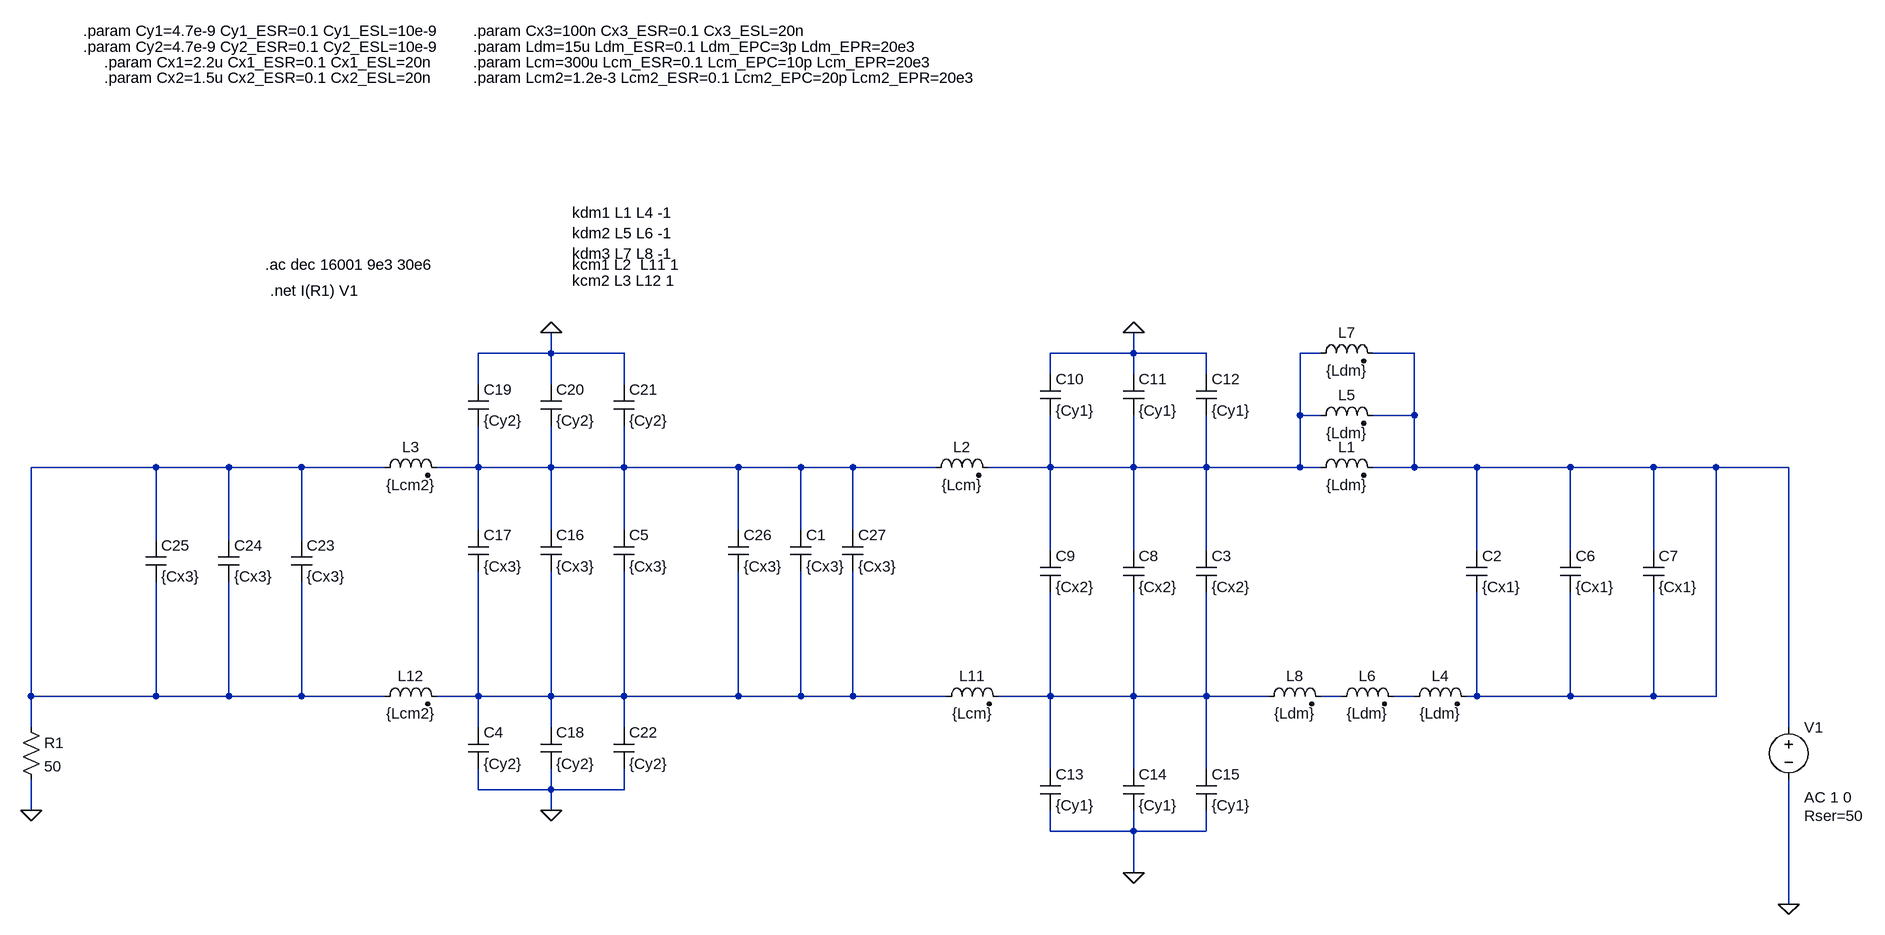
[diagram p0: schematic Simulation_PEF_1phase.asc]
Simulation_PEF_1phase.asc, the LTspice schematic file:
Version 4
SHEET 1 1792 1872
WIRE -496 -192 -496 -224
WIRE -496 -192 -608 -192
WIRE -384 -192 -496 -192
WIRE 400 -192 400 -224
WIRE 400 -192 272 -192
WIRE 512 -192 400 -192
WIRE 688 -192 656 -192
WIRE 832 -192 768 -192
WIRE 272 -160 272 -192
WIRE 400 -160 400 -192
WIRE 512 -160 512 -192
WIRE -608 -144 -608 -192
WIRE -496 -144 -496 -192
WIRE -384 -144 -384 -192
WIRE 656 -96 656 -192
WIRE 688 -96 656 -96
WIRE 832 -96 832 -192
WIRE 832 -96 768 -96
WIRE -1104 -16 -1296 -16
WIRE -992 -16 -1104 -16
WIRE -880 -16 -992 -16
WIRE -752 -16 -880 -16
WIRE -608 -16 -608 -80
WIRE -608 -16 -672 -16
WIRE -496 -16 -496 -80
WIRE -496 -16 -608 -16
WIRE -384 -16 -384 -80
WIRE -384 -16 -496 -16
WIRE -208 -16 -384 -16
WIRE -112 -16 -208 -16
WIRE -32 -16 -112 -16
WIRE 96 -16 -32 -16
WIRE 272 -16 272 -96
WIRE 272 -16 176 -16
WIRE 400 -16 400 -96
WIRE 400 -16 272 -16
WIRE 512 -16 512 -96
WIRE 512 -16 400 -16
WIRE 656 -16 656 -96
WIRE 656 -16 512 -16
WIRE 688 -16 656 -16
WIRE 832 -16 832 -96
WIRE 832 -16 768 -16
WIRE 928 -16 832 -16
WIRE 1072 -16 928 -16
WIRE 1200 -16 1072 -16
WIRE 1296 -16 1200 -16
WIRE 1408 -16 1296 -16
WIRE -608 80 -608 -16
WIRE -496 80 -496 -16
WIRE -384 80 -384 -16
WIRE -208 80 -208 -16
WIRE -112 80 -112 -16
WIRE -32 80 -32 -16
WIRE -1104 96 -1104 -16
WIRE -992 96 -992 -16
WIRE -880 96 -880 -16
WIRE 272 112 272 -16
WIRE 400 112 400 -16
WIRE 512 112 512 -16
WIRE 928 112 928 -16
WIRE 1072 112 1072 -16
WIRE 1200 112 1200 -16
WIRE -1296 336 -1296 -16
WIRE -1104 336 -1104 160
WIRE -1104 336 -1296 336
WIRE -992 336 -992 160
WIRE -992 336 -1104 336
WIRE -880 336 -880 160
WIRE -880 336 -992 336
WIRE -752 336 -880 336
WIRE -608 336 -608 144
WIRE -608 336 -672 336
WIRE -496 336 -496 144
WIRE -496 336 -608 336
WIRE -384 336 -384 144
WIRE -384 336 -496 336
WIRE -208 336 -208 144
WIRE -208 336 -384 336
WIRE -112 336 -112 144
WIRE -112 336 -208 336
WIRE -32 336 -32 144
WIRE -32 336 -112 336
WIRE 112 336 -32 336
WIRE 272 336 272 176
WIRE 272 336 192 336
WIRE 400 336 400 176
WIRE 400 336 272 336
WIRE 512 336 512 176
WIRE 512 336 400 336
WIRE 608 336 512 336
WIRE 720 336 688 336
WIRE 832 336 800 336
WIRE 928 336 928 176
WIRE 928 336 912 336
WIRE 1072 336 1072 176
WIRE 1072 336 928 336
WIRE 1200 336 1200 176
WIRE 1200 336 1072 336
WIRE 1296 336 1296 -16
WIRE 1296 336 1200 336
WIRE -1296 384 -1296 336
WIRE -608 384 -608 336
WIRE -496 384 -496 336
WIRE -384 384 -384 336
WIRE 1408 384 1408 -16
WIRE 272 448 272 336
WIRE 400 448 400 336
WIRE 512 448 512 336
WIRE -608 480 -608 448
WIRE -496 480 -496 448
WIRE -496 480 -608 480
WIRE -384 480 -384 448
WIRE -384 480 -496 480
WIRE -1296 512 -1296 464
WIRE -496 512 -496 480
WIRE 272 544 272 512
WIRE 400 544 400 512
WIRE 400 544 272 544
WIRE 512 544 512 512
WIRE 512 544 400 544
WIRE 400 608 400 544
WIRE 1408 656 1408 464
FLAG 400 608 0
FLAG 400 -224 0
FLAG -496 -224 0
FLAG -496 512 0
FLAG -1296 512 0
FLAG 1408 656 0
SYMBOL ind2 672 0 R270
WINDOW 0 32 56 VTop 2
WINDOW 3 5 56 VBottom 2
SYMATTR InstName L1
SYMATTR Value {Ldm}
SYMATTR Type ind
SYMATTR SpiceLine Rser={Ldm_ESR} Rpar={Ldm_EPR} Cpar={Ldm_EPC}
SYMBOL cap 912 112 R0
SYMATTR InstName C2
SYMATTR Value {Cx1}
SYMATTR SpiceLine Rser={Cx1_ESR} Lser={Cx1_ESL}
SYMBOL cap 496 112 R0
SYMATTR InstName C3
SYMATTR Value {Cx2}
SYMATTR SpiceLine Rser={Cx2_ESR} Lser={Cx2_ESL}
SYMBOL ind2 80 0 R270
WINDOW 0 32 56 VTop 2
WINDOW 3 5 56 VBottom 2
SYMATTR InstName L2
SYMATTR Value {Lcm}
SYMATTR Type ind
SYMATTR SpiceLine Rser={Lcm_ESR} Rpar={Lcm_EPR} Cpar={Lcm_EPC}
SYMBOL ind2 -768 0 R270
WINDOW 0 32 56 VTop 2
WINDOW 3 5 56 VBottom 2
SYMATTR InstName L3
SYMATTR Value {Lcm2}
SYMATTR Type ind
SYMATTR SpiceLine Rser={Lcm2_ESR} Rpar={Lcm2_EPR} Cpar={Lcm2_EPC}
SYMBOL cap -624 384 R0
SYMATTR InstName C4
SYMATTR Value {Cy2}
SYMATTR SpiceLine Rser={Cy2_ESR} Lser={Cy2_ESL}
SYMBOL cap -400 80 R0
SYMATTR InstName C5
SYMATTR Value {Cx3}
SYMATTR SpiceLine Rser={Cx3_ESR} Lser={Cx3_ESL}
SYMBOL cap 1056 112 R0
SYMATTR InstName C6
SYMATTR Value {Cx1}
SYMATTR SpiceLine Rser={Cx1_ESR} Lser={Cx1_ESL}
SYMBOL cap 1184 112 R0
SYMATTR InstName C7
SYMATTR Value {Cx1}
SYMATTR SpiceLine Rser={Cx1_ESR} Lser={Cx1_ESL}
SYMBOL ind2 816 352 R270
WINDOW 0 32 56 VTop 2
WINDOW 3 5 56 VBottom 2
SYMATTR InstName L4
SYMATTR Value {Ldm}
SYMATTR Type ind
SYMATTR SpiceLine Rser={Ldm_ESR} Rpar={Ldm_EPR} Cpar={Ldm_EPC}
SYMBOL ind2 704 352 R270
WINDOW 0 32 56 VTop 2
WINDOW 3 5 56 VBottom 2
SYMATTR InstName L6
SYMATTR Value {Ldm}
SYMATTR Type ind
SYMATTR SpiceLine Rser={Ldm_ESR} Rpar={Ldm_EPR} Cpar={Ldm_EPC}
SYMBOL ind2 592 352 R270
WINDOW 0 32 56 VTop 2
WINDOW 3 5 56 VBottom 2
SYMATTR InstName L8
SYMATTR Value {Ldm}
SYMATTR Type ind
SYMATTR SpiceLine Rser={Ldm_ESR} Rpar={Ldm_EPR} Cpar={Ldm_EPC}
SYMBOL cap 384 112 R0
SYMATTR InstName C8
SYMATTR Value {Cx2}
SYMATTR SpiceLine Rser={Cx2_ESR} Lser={Cx2_ESL}
SYMBOL cap 256 112 R0
SYMATTR InstName C9
SYMATTR Value {Cx2}
SYMATTR SpiceLine Rser={Cx2_ESR} Lser={Cx2_ESL}
SYMBOL ind2 96 352 R270
WINDOW 0 32 56 VTop 2
WINDOW 3 5 56 VBottom 2
SYMATTR InstName L11
SYMATTR Value {Lcm}
SYMATTR Type ind
SYMATTR SpiceLine Rser={Lcm_ESR} Rpar={Lcm_EPR} Cpar={Lcm_EPC}
SYMBOL cap 256 -160 R0
SYMATTR InstName C10
SYMATTR Value {Cy1}
SYMATTR SpiceLine Rser={Cy1_ESR} Lser={Cy1_ESL}
SYMBOL cap 384 -160 R0
SYMATTR InstName C11
SYMATTR Value {Cy1}
SYMATTR SpiceLine Rser={Cy1_ESR} Lser={Cy1_ESL}
SYMBOL cap 496 -160 R0
SYMATTR InstName C12
SYMATTR Value {Cy1}
SYMATTR SpiceLine Rser={Cy1_ESR} Lser={Cy1_ESL}
SYMBOL cap 256 448 R0
SYMATTR InstName C13
SYMATTR Value {Cy1}
SYMATTR SpiceLine Rser={Cy1_ESR} Lser={Cy1_ESL}
SYMBOL cap 384 448 R0
SYMATTR InstName C14
SYMATTR Value {Cy1}
SYMATTR SpiceLine Rser={Cy1_ESR} Lser={Cy1_ESL}
SYMBOL cap 496 448 R0
SYMATTR InstName C15
SYMATTR Value {Cy1}
SYMATTR SpiceLine Rser={Cy1_ESR} Lser={Cy1_ESL}
SYMBOL cap -512 80 R0
SYMATTR InstName C16
SYMATTR Value {Cx3}
SYMATTR SpiceLine Rser={Cx3_ESR} Lser={Cx3_ESL}
SYMBOL cap -624 80 R0
SYMATTR InstName C17
SYMATTR Value {Cx3}
SYMATTR SpiceLine Rser={Cx3_ESR} Lser={Cx3_ESL}
SYMBOL ind2 -768 352 R270
WINDOW 0 32 56 VTop 2
WINDOW 3 5 56 VBottom 2
SYMATTR InstName L12
SYMATTR Value {Lcm2}
SYMATTR Type ind
SYMATTR SpiceLine Rser={Lcm2_ESR} Rpar={Lcm2_EPR} Cpar={Lcm2_EPC}
SYMBOL cap -512 384 R0
SYMATTR InstName C18
SYMATTR Value {Cy2}
SYMATTR SpiceLine Rser={Cy2_ESR} Lser={Cy2_ESL}
SYMBOL cap -624 -144 R0
SYMATTR InstName C19
SYMATTR Value {Cy2}
SYMATTR SpiceLine Rser={Cy2_ESR} Lser={Cy2_ESL}
SYMBOL cap -512 -144 R0
SYMATTR InstName C20
SYMATTR Value {Cy2}
SYMATTR SpiceLine Rser={Cy2_ESR} Lser={Cy2_ESL}
SYMBOL cap -400 -144 R0
SYMATTR InstName C21
SYMATTR Value {Cy2}
SYMATTR SpiceLine Rser={Cy2_ESR} Lser={Cy2_ESL}
SYMBOL cap -400 384 R0
SYMATTR InstName C22
SYMATTR Value {Cy2}
SYMATTR SpiceLine Rser={Cy2_ESR} Lser={Cy2_ESL}
SYMBOL cap -896 96 R0
SYMATTR InstName C23
SYMATTR Value {Cx3}
SYMATTR SpiceLine Rser={Cx3_ESR} Lser={Cx3_ESL}
SYMBOL cap -1008 96 R0
SYMATTR InstName C24
SYMATTR Value {Cx3}
SYMATTR SpiceLine Rser={Cx3_ESR} Lser={Cx3_ESL}
SYMBOL cap -1120 96 R0
SYMATTR InstName C25
SYMATTR Value {Cx3}
SYMATTR SpiceLine Rser={Cx3_ESR} Lser={Cx3_ESL}
SYMBOL voltage 1408 368 R0
WINDOW 123 24 124 Left 2
WINDOW 39 24 152 Left 2
SYMATTR Value2 AC 1 0
SYMATTR SpiceLine Rser=50
SYMATTR InstName V1
SYMATTR Value ""
SYMBOL res -1312 368 R0
SYMATTR InstName R1
SYMATTR Value 50
SYMBOL cap -224 80 R0
SYMATTR InstName C26
SYMATTR Value {Cx3}
SYMATTR SpiceLine Rser={Cx3_ESR} Lser={Cx3_ESL}
SYMBOL cap -128 80 R0
SYMATTR InstName C1
SYMATTR Value {Cx3}
SYMATTR SpiceLine Rser={Cx3_ESR} Lser={Cx3_ESL}
SYMBOL cap -48 80 R0
SYMATTR InstName C27
SYMATTR Value {Cx3}
SYMATTR SpiceLine Rser={Cx3_ESR} Lser={Cx3_ESL}
SYMBOL ind2 672 -80 R270
WINDOW 0 32 56 VTop 2
WINDOW 3 5 56 VBottom 2
SYMATTR InstName L5
SYMATTR Value {Ldm}
SYMATTR Type ind
SYMATTR SpiceLine Rser={Ldm_ESR} Rpar={Ldm_EPR} Cpar={Ldm_EPC}
SYMBOL ind2 672 -176 R270
WINDOW 0 32 56 VTop 2
WINDOW 3 5 56 VBottom 2
SYMATTR InstName L7
SYMATTR Value {Ldm}
SYMATTR Type ind
SYMATTR SpiceLine Rser={Ldm_ESR} Rpar={Ldm_EPR} Cpar={Ldm_EPC}
TEXT -1216 -664 Left 2 !.param Cy2=4.7e-9 Cy2_ESR=0.1 Cy2_ESL=10e-9
TEXT -1184 -640 Left 2 !.param Cx1=2.2u Cx1_ESR=0.1 Cx1_ESL=20n
TEXT -1216 -688 Left 2 !.param Cy1=4.7e-9 Cy1_ESR=0.1 Cy1_ESL=10e-9
TEXT -1184 -616 Left 2 !.param Cx2=1.5u Cx2_ESR=0.1 Cx2_ESL=20n
TEXT -616 -688 Left 2 !.param Cx3=100n Cx3_ESR=0.1 Cx3_ESL=20n
TEXT -616 -664 Left 2 !.param Ldm=15u Ldm_ESR=0.1 Ldm_EPC=3p Ldm_EPR=20e3
TEXT -616 -640 Left 2 !.param Lcm=300u Lcm_ESR=0.1 Lcm_EPC=10p Lcm_EPR=20e3
TEXT -616 -616 Left 2 !.param Lcm2=1.2e-3 Lcm2_ESR=0.1 Lcm2_EPC=20p Lcm2_EPR=20e3
TEXT -464 -408 Left 2 !kdm1 L1 L4 -1\nkdm2 L5 L6 -1\nkdm3 L7 L8 -1
TEXT -464 -328 Left 2 !kcm1 L2  L11 1
TEXT -464 -304 Left 2 !kcm2 L3 L12 1
TEXT -928 -288 Left 2 !.net I(R1) V1
TEXT -936 -328 Left 2 !.ac dec 16001 9e3 30e6

The netlist it stands for:
* Simulation_PEF_1phase.asc
L1 N001 N002 {Ldm} Rser={Ldm_ESR} Rpar={Ldm_EPR} Cpar={Ldm_EPC}
C2 N002 N002 {Cx1} Rser={Cx1_ESR} Lser={Cx1_ESL}
C3 N001 N006 {Cx2} Rser={Cx2_ESR} Lser={Cx2_ESL}
L2 N004 N001 {Lcm} Rser={Lcm_ESR} Rpar={Lcm_EPR} Cpar={Lcm_EPC}
L3 N003 N004 {Lcm2} Rser={Lcm2_ESR} Rpar={Lcm2_EPR} Cpar={Lcm2_EPC}
C4 N005 0 {Cy2} Rser={Cy2_ESR} Lser={Cy2_ESL}
C5 N004 N005 {Cx3} Rser={Cx3_ESR} Lser={Cx3_ESL}
C6 N002 N002 {Cx1} Rser={Cx1_ESR} Lser={Cx1_ESL}
C7 N002 N002 {Cx1} Rser={Cx1_ESR} Lser={Cx1_ESL}
L4 N008 N002 {Ldm} Rser={Ldm_ESR} Rpar={Ldm_EPR} Cpar={Ldm_EPC}
L6 N007 N008 {Ldm} Rser={Ldm_ESR} Rpar={Ldm_EPR} Cpar={Ldm_EPC}
L8 N006 N007 {Ldm} Rser={Ldm_ESR} Rpar={Ldm_EPR} Cpar={Ldm_EPC}
C8 N001 N006 {Cx2} Rser={Cx2_ESR} Lser={Cx2_ESL}
C9 N001 N006 {Cx2} Rser={Cx2_ESR} Lser={Cx2_ESL}
L11 N005 N006 {Lcm} Rser={Lcm_ESR} Rpar={Lcm_EPR} Cpar={Lcm_EPC}
C10 0 N001 {Cy1} Rser={Cy1_ESR} Lser={Cy1_ESL}
C11 0 N001 {Cy1} Rser={Cy1_ESR} Lser={Cy1_ESL}
C12 0 N001 {Cy1} Rser={Cy1_ESR} Lser={Cy1_ESL}
C13 N006 0 {Cy1} Rser={Cy1_ESR} Lser={Cy1_ESL}
C14 N006 0 {Cy1} Rser={Cy1_ESR} Lser={Cy1_ESL}
C15 N006 0 {Cy1} Rser={Cy1_ESR} Lser={Cy1_ESL}
C16 N004 N005 {Cx3} Rser={Cx3_ESR} Lser={Cx3_ESL}
C17 N004 N005 {Cx3} Rser={Cx3_ESR} Lser={Cx3_ESL}
L12 N003 N005 {Lcm2} Rser={Lcm2_ESR} Rpar={Lcm2_EPR} Cpar={Lcm2_EPC}
C18 N005 0 {Cy2} Rser={Cy2_ESR} Lser={Cy2_ESL}
C19 0 N004 {Cy2} Rser={Cy2_ESR} Lser={Cy2_ESL}
C20 0 N004 {Cy2} Rser={Cy2_ESR} Lser={Cy2_ESL}
C21 0 N004 {Cy2} Rser={Cy2_ESR} Lser={Cy2_ESL}
C22 N005 0 {Cy2} Rser={Cy2_ESR} Lser={Cy2_ESL}
C23 N003 N003 {Cx3} Rser={Cx3_ESR} Lser={Cx3_ESL}
C24 N003 N003 {Cx3} Rser={Cx3_ESR} Lser={Cx3_ESL}
C25 N003 N003 {Cx3} Rser={Cx3_ESR} Lser={Cx3_ESL}
V1 N002 0 AC 1 0 Rser=50
R1 N003 0 50
C26 N004 N005 {Cx3} Rser={Cx3_ESR} Lser={Cx3_ESL}
C1 N004 N005 {Cx3} Rser={Cx3_ESR} Lser={Cx3_ESL}
C27 N004 N005 {Cx3} Rser={Cx3_ESR} Lser={Cx3_ESL}
L5 N001 N002 {Ldm} Rser={Ldm_ESR} Rpar={Ldm_EPR} Cpar={Ldm_EPC}
L7 N001 N002 {Ldm} Rser={Ldm_ESR} Rpar={Ldm_EPR} Cpar={Ldm_EPC}
.param Cy2=4.7e-9 Cy2_ESR=0.1 Cy2_ESL=10e-9
.param Cx1=2.2u Cx1_ESR=0.1 Cx1_ESL=20n
.param Cy1=4.7e-9 Cy1_ESR=0.1 Cy1_ESL=10e-9
.param Cx2=1.5u Cx2_ESR=0.1 Cx2_ESL=20n
.param Cx3=100n Cx3_ESR=0.1 Cx3_ESL=20n
.param Ldm=15u Ldm_ESR=0.1 Ldm_EPC=3p Ldm_EPR=20e3
.param Lcm=300u Lcm_ESR=0.1 Lcm_EPC=10p Lcm_EPR=20e3
.param Lcm2=1.2e-3 Lcm2_ESR=0.1 Lcm2_EPC=20p Lcm2_EPR=20e3
kdm1 L1 L4 -1
kdm2 L5 L6 -1
kdm3 L7 L8 -1
kcm1 L2  L11 1
kcm2 L3 L12 1
.net I(R1) V1
.ac dec 16001 9e3 30e6
.backanno
.end